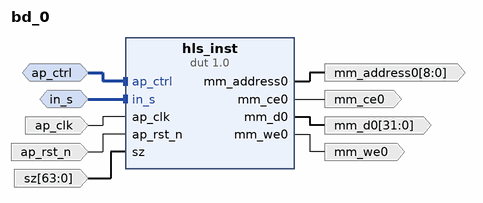
[diagram p0: block diagram of the top level]
# Vivado block design bd_0, xc7z020clg400-1, Vivado 2024.2
create_bd_design bd_0

create_bd_intf_port -mode Slave -vlnv xilinx.com:interface:acc_handshake_rtl:1.0 ap_ctrl
create_bd_intf_port -mode Slave -vlnv xilinx.com:interface:axis_rtl:1.0 in_s
set_property -dict [list \
  CONFIG.FREQ_HZ 303000000.0 \
  CONFIG.HAS_TKEEP 1 \
  CONFIG.HAS_TLAST 1 \
  CONFIG.HAS_TREADY 1 \
  CONFIG.HAS_TSTRB 1 \
  CONFIG.LAYERED_METADATA undef \
  CONFIG.TDATA_NUM_BYTES 4 \
  CONFIG.TDEST_WIDTH 0 \
  CONFIG.TID_WIDTH 0 \
  CONFIG.TUSER_WIDTH 0 \
] [get_bd_intf_ports in_s]
create_bd_port -dir I -type clk ap_clk
set_property -dict {CONFIG.FREQ_HZ 303000000.0} [get_bd_ports ap_clk]
create_bd_port -dir I -type rst ap_rst_n
create_bd_port -dir O -from 8 -to 0 -type data mm_address0
create_bd_port -dir O mm_ce0
create_bd_port -dir O -from 31 -to 0 -type data mm_d0
create_bd_port -dir O mm_we0
create_bd_port -dir I -from 63 -to 0 -type data sz

create_bd_cell -type ip -vlnv xilinx.com:hls:dut:1.0 hls_inst

# ---- connections ----

connect_bd_intf_net -intf_net ap_ctrl_0_1 [get_bd_intf_ports ap_ctrl] [get_bd_intf_pins hls_inst/ap_ctrl]
connect_bd_intf_net -intf_net in_s_0_1 [get_bd_intf_ports in_s] [get_bd_intf_pins hls_inst/in_s]
connect_bd_net -net ap_clk_0_1 [get_bd_ports ap_clk] [get_bd_pins hls_inst/ap_clk]
connect_bd_net -net ap_rst_n_0_1 [get_bd_ports ap_rst_n] [get_bd_pins hls_inst/ap_rst_n]
connect_bd_net [get_bd_pins hls_inst/mm_address0] [get_bd_ports mm_address0]
connect_bd_net [get_bd_pins hls_inst/mm_ce0] [get_bd_ports mm_ce0]
connect_bd_net [get_bd_pins hls_inst/mm_d0] [get_bd_ports mm_d0]
connect_bd_net [get_bd_pins hls_inst/mm_we0] [get_bd_ports mm_we0]
connect_bd_net -net sz_0_1 [get_bd_ports sz] [get_bd_pins hls_inst/sz]

validate_bd_design
save_bd_design
